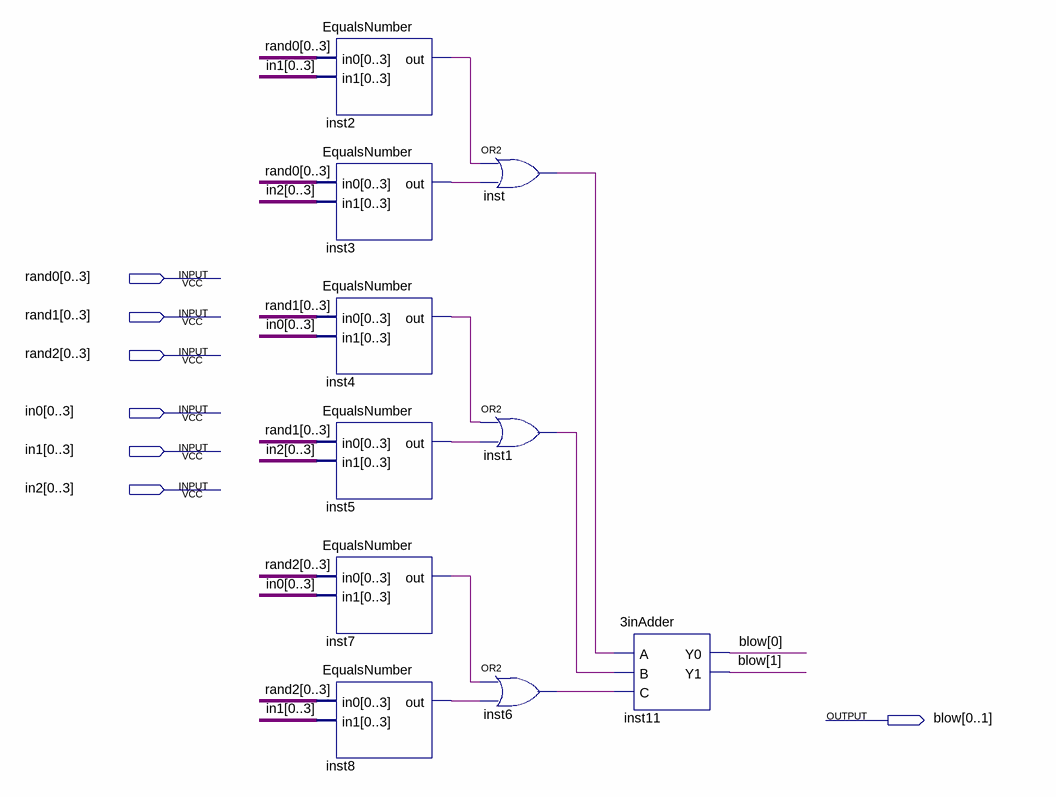
[diagram p0: schematic sheet]
// Quartus schematic CheckBlow.bdf as structural Verilog: 10 symbols, 7 pins
module CheckBlow (
  input  [0:3] rand0,
  input  [0:3] rand1,
  input  [0:3] rand2,
  input  [0:3] in0,
  input  [0:3] in1,
  input  [0:3] in2,
  output [0:1] blow
);

  wire inst1_out, inst2_out, inst3_out, inst4_out, inst5_out, inst6_out, inst7_out, inst8_out, inst_out;

  EqualsNumber inst2 (.in0(rand0), .in1(in1), .out(inst2_out));
  EqualsNumber inst3 (.in0(rand0), .in1(in2), .out(inst3_out));
  EqualsNumber inst4 (.in0(rand1), .in1(in0), .out(inst4_out));
  EqualsNumber inst5 (.in0(rand1), .in1(in2), .out(inst5_out));
  EqualsNumber inst7 (.in0(rand2), .in1(in0), .out(inst7_out));
  EqualsNumber inst8 (.in0(rand2), .in1(in1), .out(inst8_out));
  or inst (inst_out, inst2_out, inst3_out);
  or inst1 (inst1_out, inst4_out, inst5_out);
  or inst6 (inst6_out, inst7_out, inst8_out);
  \3inAdder  inst11 (.A(inst_out), .B(inst1_out), .C(inst6_out), .Y0(blow[0]), .Y1(blow[1]));
endmodule
